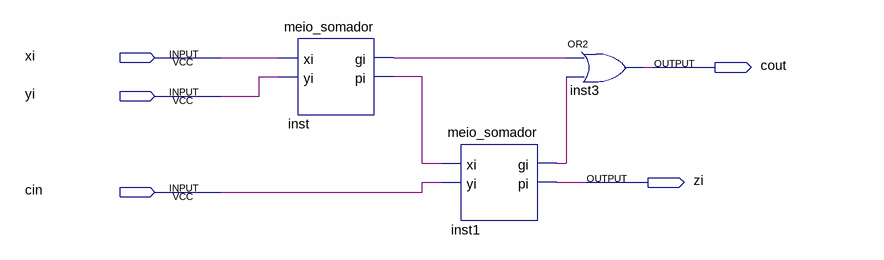
[diagram p0: schematic sheet]
// Quartus schematic somador_completo.bdf as structural Verilog: 3 symbols, 5 pins
module somador_completo (
  input  xi,
  input  yi,
  input  cin,
  output cout,
  output zi
);

  wire inst1_gi, inst_gi, inst_pi;

  meio_somador inst (.xi(xi), .yi(yi), .gi(inst_gi), .pi(inst_pi));
  meio_somador inst1 (.xi(inst_pi), .yi(cin), .gi(inst1_gi), .pi(zi));
  or inst3 (cout, inst_gi, inst1_gi);
endmodule
